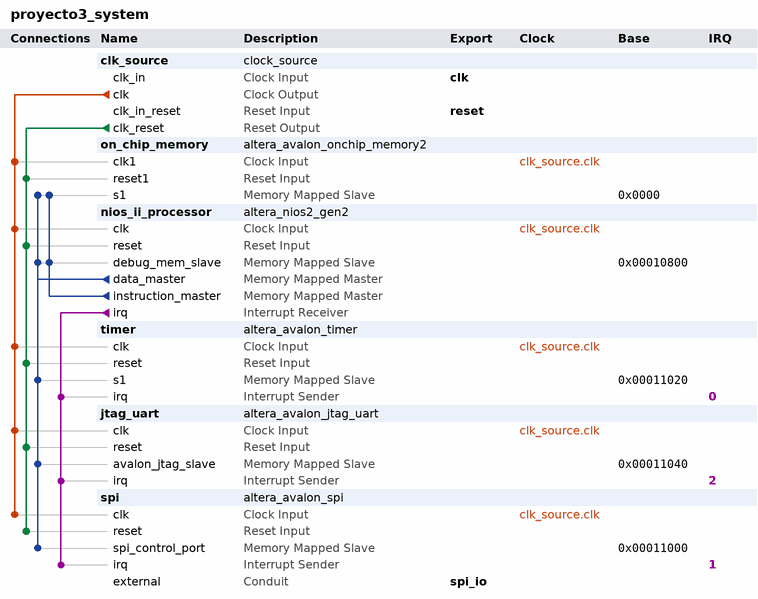
[diagram p0: system contents]
# Platform Designer (Qsys) system proyecto3_system, Cyclone V 5CSEMA4U23C6
# Parameters at their usual value, and those the tool derives, are not listed.
package require -exact qsys 16.1
create_system proyecto3_system
set_project_property DEVICE_FAMILY {Cyclone V}
set_project_property DEVICE 5CSEMA4U23C6

add_instance clk_source clock_source 16.1
set_instance_parameter_value clk_source clockFrequency 50000000

add_instance on_chip_memory altera_avalon_onchip_memory2 16.1
set_instance_parameter_value on_chip_memory dataWidth 32
set_instance_parameter_value on_chip_memory dualPort false
set_instance_parameter_value on_chip_memory initMemContent true
set_instance_parameter_value on_chip_memory initializationFileName onchip_mem.hex
set_instance_parameter_value on_chip_memory memorySize 65536

add_instance nios_ii_processor altera_nios2_gen2 16.1
set_instance_parameter_value nios_ii_processor dcache_size 2048
set_instance_parameter_value nios_ii_processor exceptionSlave on_chip_memory.s1
set_instance_parameter_value nios_ii_processor icache_size 4096
set_instance_parameter_value nios_ii_processor impl Tiny
set_instance_parameter_value nios_ii_processor resetSlave on_chip_memory.s1

add_instance timer altera_avalon_timer 16.1
set_instance_parameter_value timer period 1
set_instance_parameter_value timer periodUnits MSEC

add_instance jtag_uart altera_avalon_jtag_uart 16.1
set_instance_parameter_value jtag_uart simInteractiveOptions NO_INTERACTIVE_WINDOWS

add_instance spi altera_avalon_spi 16.1
set_instance_parameter_value spi clockPolarity 0
set_instance_parameter_value spi dataWidth 8
set_instance_parameter_value spi masterSPI true
set_instance_parameter_value spi numberOfSlaves 1
set_instance_parameter_value spi targetClockRate 128000

# connections
add_connection clk_source.clk jtag_uart.clk clock
add_connection clk_source.clk nios_ii_processor.clk clock
add_connection clk_source.clk on_chip_memory.clk1 clock
add_connection clk_source.clk spi.clk clock
add_connection clk_source.clk timer.clk clock
add_connection clk_source.clk_reset jtag_uart.reset reset
add_connection clk_source.clk_reset nios_ii_processor.reset reset
add_connection clk_source.clk_reset on_chip_memory.reset1 reset
add_connection clk_source.clk_reset spi.reset reset
add_connection clk_source.clk_reset timer.reset reset
add_connection nios_ii_processor.data_master jtag_uart.avalon_jtag_slave avalon
set_connection_parameter_value nios_ii_processor.data_master/jtag_uart.avalon_jtag_slave baseAddress 0x00011040
add_connection nios_ii_processor.data_master nios_ii_processor.debug_mem_slave avalon
set_connection_parameter_value nios_ii_processor.data_master/nios_ii_processor.debug_mem_slave baseAddress 0x00010800
add_connection nios_ii_processor.data_master on_chip_memory.s1 avalon
set_connection_parameter_value nios_ii_processor.data_master/on_chip_memory.s1 baseAddress 0x0000
add_connection nios_ii_processor.data_master spi.spi_control_port avalon
set_connection_parameter_value nios_ii_processor.data_master/spi.spi_control_port baseAddress 0x00011000
add_connection nios_ii_processor.data_master timer.s1 avalon
set_connection_parameter_value nios_ii_processor.data_master/timer.s1 baseAddress 0x00011020
add_connection nios_ii_processor.instruction_master nios_ii_processor.debug_mem_slave avalon
set_connection_parameter_value nios_ii_processor.instruction_master/nios_ii_processor.debug_mem_slave baseAddress 0x00010800
add_connection nios_ii_processor.instruction_master on_chip_memory.s1 avalon
set_connection_parameter_value nios_ii_processor.instruction_master/on_chip_memory.s1 baseAddress 0x0000
add_connection nios_ii_processor.irq jtag_uart.irq interrupt
set_connection_parameter_value nios_ii_processor.irq/jtag_uart.irq irqNumber 2
add_connection nios_ii_processor.irq spi.irq interrupt
set_connection_parameter_value nios_ii_processor.irq/spi.irq irqNumber 1
add_connection nios_ii_processor.irq timer.irq interrupt
set_connection_parameter_value nios_ii_processor.irq/timer.irq irqNumber 0

# exported interfaces
add_interface clk clock sink
set_interface_property clk EXPORT_OF clk_source.clk_in
add_interface reset reset sink
set_interface_property reset EXPORT_OF clk_source.clk_in_reset
add_interface spi_io conduit end
set_interface_property spi_io EXPORT_OF spi.external

set_interconnect_requirement {$system} qsys_mm.clockCrossingAdapter HANDSHAKE
set_interconnect_requirement {$system} qsys_mm.enableEccProtection FALSE
set_interconnect_requirement {$system} qsys_mm.insertDefaultSlave FALSE
set_interconnect_requirement {$system} qsys_mm.maxAdditionalLatency 1

save_system proyecto3_system.qsys
